# Altium schematic sheet Pressure_MCU407.SchDoc
size A3
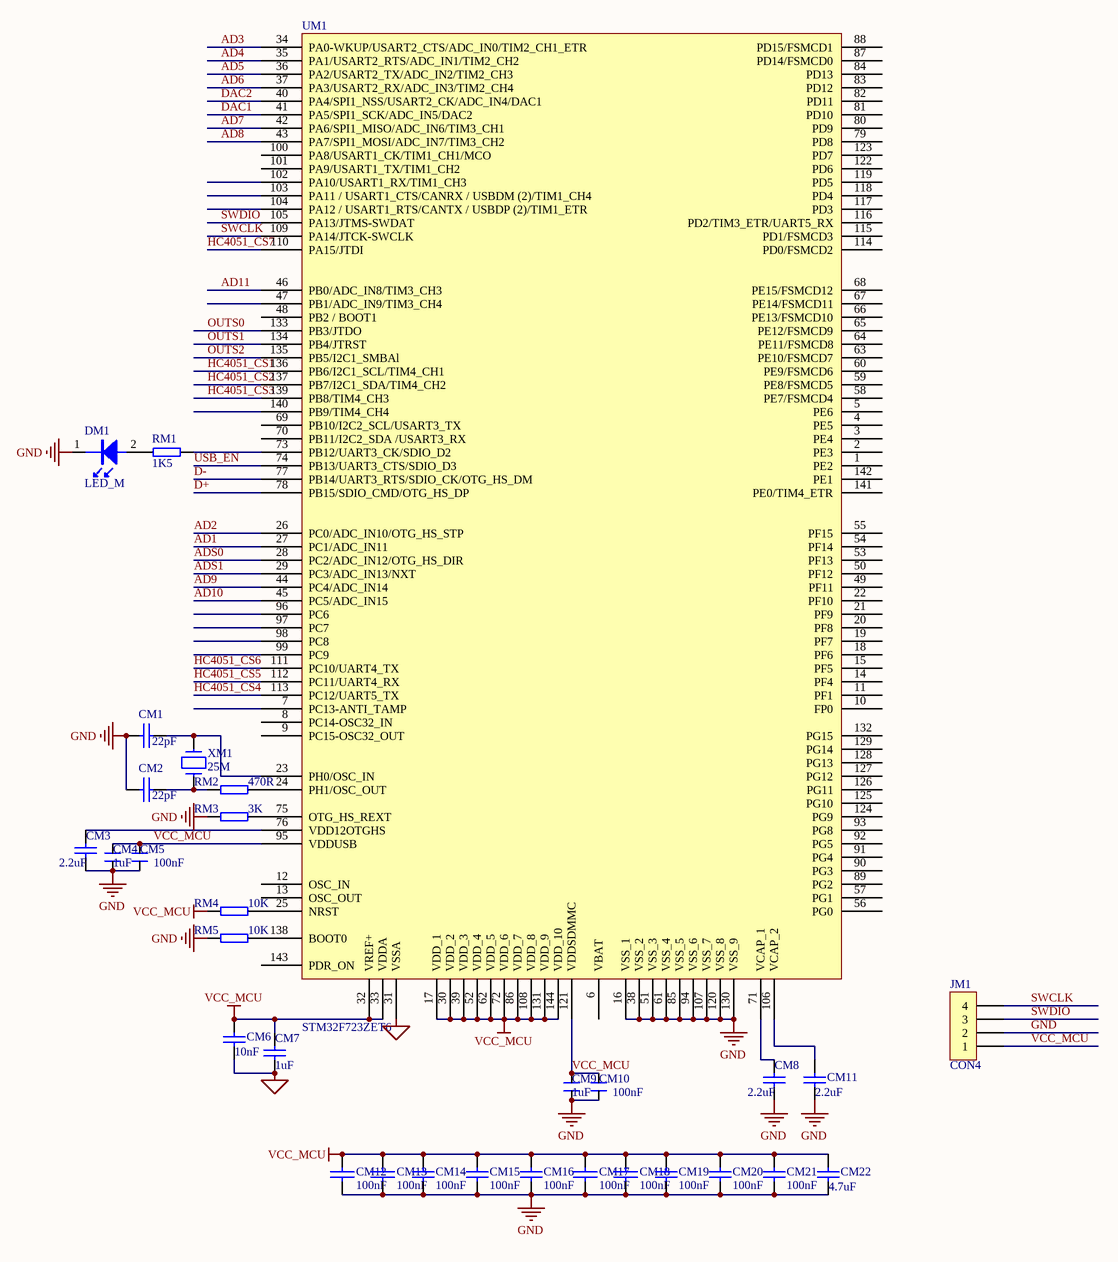
[diagram p0: Pressure_MCU407.SchDoc]

## Parts
CM1  22pF  [C0603_HSC100]
CM2  22pF  [c0603_HSC100]
CM3  2.2uF  [C0805]
CM4  1uF  [C0603_HSC100]
CM5  100nF  [C0603_HSC100]
CM6  10nF  [c0603_HSC100]
CM7  1uF  [c0603_HSC100]
CM8  2.2uF  [C0805]
CM9  1uF  [C0603_HSC100]
CM10  100nF  [C0603_HSC100]
CM11  2.2uF  [C0805]
CM12  100nF  [c0603_HSC100]
CM13  100nF  [c0603_HSC100]
CM14  100nF  [c0603_HSC100]
CM15  100nF  [c0603_HSC100]
CM16  100nF  [c0603_HSC100]
CM17  100nF  [c0603_HSC100]
CM18  100nF  [c0603_HSC100]
CM19  100nF  [c0603_HSC100]
CM20  100nF  [c0603_HSC100]
CM21  100nF  [c0603_HSC100]
CM22  4.7uF  [C0805]
DM1  LED_M  [LED_HSC100]
JM1  CON4  [SIP_4M_1.27]
RM1  1K5  [R0603_HSC100]
RM2  470R  [R0603_HSC100]
RM3  3K  [R0603_HSC100]
RM4  10K  [R0603_HSC100]
RM5  10K  [R0603_HSC100]
UM1  STM32F723ZET6  [LQFP144]
XM1  25M  [CRYSTAL_SMD]

## Nets
AGND: CM6.2 CM7.2 UM1.31(VSSA)
GND: CM1.1 CM2.1 CM3.1 CM4.2 CM5.2 CM8.1 CM9.2 CM10.2 CM11.1 CM12.2 CM13.2 CM14.1 CM15.1 CM16.1 CM17.2 CM18.2 CM19.1 CM20.1 CM21.1 CM22.1 DM1.1 JM1.2 RM3.2 RM5.1 UM1.16(VSS_1) UM1.38(VSS_2) UM1.51(VSS_3) UM1.61(VSS_4) UM1.85(VSS_5) UM1.94(VSS_6) UM1.107(VSS_7) UM1.120(VSS_8) UM1.130(VSS_9)
VCC_MCU: CM4.1 CM5.1 CM6.1 CM7.1 CM9.1 CM10.1 CM12.1 CM13.1 CM14.2 CM15.2 CM16.2 CM17.1 CM18.1 CM19.2 CM20.2 CM21.2 CM22.2 JM1.1 RM4.2 UM1.17(VDD_1) UM1.30(VDD_2) UM1.32(VREF+) UM1.33(VDDA) UM1.39(VDD_3) UM1.52(VDD_4) UM1.62(VDD_5) UM1.72(VDD_6) UM1.86(VDD_7) UM1.95(VDDUSB) UM1.108(VDD_8) UM1.121(VDDSDMMC) UM1.131(VDD_9) UM1.144(VDD_10)
AD1: UM1.27(PC1/ADC_IN11)
AD2: UM1.26(PC0/ADC_IN10/OTG_HS_STP)
AD3: UM1.34(PA0-WKUP/USART2_CTS/ADC_IN0/TIM2_CH1_ETR)
AD4: UM1.35(PA1/USART2_RTS/ADC_IN1/TIM2_CH2)
AD5: UM1.36(PA2/USART2_TX/ADC_IN2/TIM2_CH3)
AD6: UM1.37(PA3/USART2_RX/ADC_IN3/TIM2_CH4)
AD7: UM1.42(PA6/SPI1_MISO/ADC_IN6/TIM3_CH1)
AD8: UM1.43(PA7/SPI1_MOSI/ADC_IN7/TIM3_CH2)
AD9: UM1.44(PC4/ADC_IN14)
AD10: UM1.45(PC5/ADC_IN15)
AD11: UM1.46(PB0/ADC_IN8/TIM3_CH3)
ADS0: UM1.28(PC2/ADC_IN12/OTG_HS_DIR)
ADS1: UM1.29(PC3/ADC_IN13/NXT)
D+: UM1.78(PB15/SDIO_CMD/OTG_HS_DP)
D-: UM1.77(PB14/UART3_RTS/SDIO_CK/OTG_HS_DM)
DAC1: UM1.41(PA5/SPI1_SCK/ADC_IN5/DAC2)
DAC2: UM1.40(PA4/SPI1_NSS/USART2_CK/ADC_IN4/DAC1)
HC4051_CS1: UM1.136(PB6/I2C1_SCL/TIM4_CH1)
HC4051_CS2: UM1.137(PB7/I2C1_SDA/TIM4_CH2)
HC4051_CS3: UM1.139(PB8/TIM4_CH3)
HC4051_CS4: UM1.113(PC12/UART5_TX)
HC4051_CS5: UM1.112(PC11/UART4_RX)
HC4051_CS6: UM1.111(PC10/UART4_TX)
HC4051_CS7: UM1.110(PA15/JTDI)
OUTS0: UM1.133(PB3/JTDO)
OUTS1: UM1.134(PB4/JTRST)
OUTS2: UM1.135(PB5/I2C1_SMBAl)
SWCLK: JM1.4 UM1.109(PA14/JTCK-SWCLK)
SWDIO: JM1.3 UM1.105(PA13/JTMS-SWDAT)
USB_EN: UM1.74(PB13/UART3_CTS/SDIO_D3)
NetCM1_2: CM1.2 UM1.23(PH0/OSC_IN) XM1.2
NetCM2_2: CM2.2 RM2.2 XM1.1
NetCM3_2: CM3.2 UM1.76(VDD12OTGHS)
NetCM8_2: CM8.2 UM1.71(VCAP_1)
NetCM11_2: CM11.2 UM1.106(VCAP_2)
NetDM1_2: DM1.2 RM1.2
NetRM1_1: RM1.1 UM1.73(PB12/UART3_CK/SDIO_D2)
NetRM2_1: RM2.1 UM1.24(PH1/OSC_OUT)
NetRM3_1: RM3.1 UM1.75(OTG_HS_REXT)
NetRM4_1: RM4.1 UM1.25(NRST)
NetRM5_2: RM5.2 UM1.138(BOOT0)

Not connected (* = marked no-connect by the designer): UM1 1(PE2) 2(PE3) 3(PE4) 4(PE5) 5(PE6) 6(VBAT) 7(PC13-ANTI_TAMP) 8(PC14-OSC32_IN) 9(PC15-OSC32_OUT) 10(FP0) 11(PF1) 12(OSC_IN) 13(OSC_OUT) 14(PF4) 15(PF5) 18(PF6) 19(PF7) 20(PF8) 21(PF9) 22(PF10) 47(PB1/ADC_IN9/TIM3_CH4) 48(PB2_/_BOOT1) 49(PF11) 50(PF12) 53(PF13) 54(PF14) 55(PF15) 56(PG0) 57(PG1) 58(PE7/FSMCD4) 59(PE8/FSMCD5) 60(PE9/FSMCD6) 63(PE10/FSMCD7) 64(PE11/FSMCD8) 65(PE12/FSMCD9) 66(PE13/FSMCD10) 67(PE14/FSMCD11) 68(PE15/FSMCD12) 69(PB10/I2C2_SCL/USART3_TX) 70(PB11/I2C2_SDA_/USART3_RX) 79(PD8) 80(PD9) 81(PD10) 82(PD11) 83(PD12) 84(PD13) 87(PD14/FSMCD0) 88(PD15/FSMCD1) 89(PG2) 90(PG3) 91(PG4) 92(PG5) 93(PG8) 96(PC6) 97(PC7) 98(PC8) 99(PC9) 100(PA8/USART1_CK/TIM1_CH1/MCO) 101(PA9/USART1_TX/TIM1_CH2) 102(PA10/USART1_RX/TIM1_CH3) 103(PA11_/_USART1_CTS/CANRX_/_USBDM_(2)/TIM1_CH4) 104(PA12_/_USART1_RTS/CANTX_/_USBDP_(2)/TIM1_ETR) 114(PD0/FSMCD2) 115(PD1/FSMCD3) 116(PD2/TIM3_ETR/UART5_RX) 117(PD3) 118(PD4) 119(PD5) 122(PD6) 123(PD7) 124(PG9) 125(PG10) 126(PG11) 127(PG12) 128(PG13) 129(PG14) 132(PG15) 140(PB9/TIM4_CH4) 141(PE0/TIM4_ETR) 142(PE1) 143(PDR_ON)

## Library data of the parts
CM1 CM2 CM12 CM13 CM17 CM18 = CAP: Capacitor
CM3 CM6-CM8 CM11 CM14-CM16 CM19-CM22 = Cap: Capacitor; Value: 104; Published: 8-Jun-2000; LatestRevisionDate: 17-Jul-2002; LatestRevisionNote: Re-released for DXP Platform.; Publisher: Altium Limited
CM4 CM5 CM9 CM10 = CAP_M
JM1 = CON4: Connector
RM1 RM5 = RES_M
RM2-RM4 = RES
XM1 = CRYSTAL